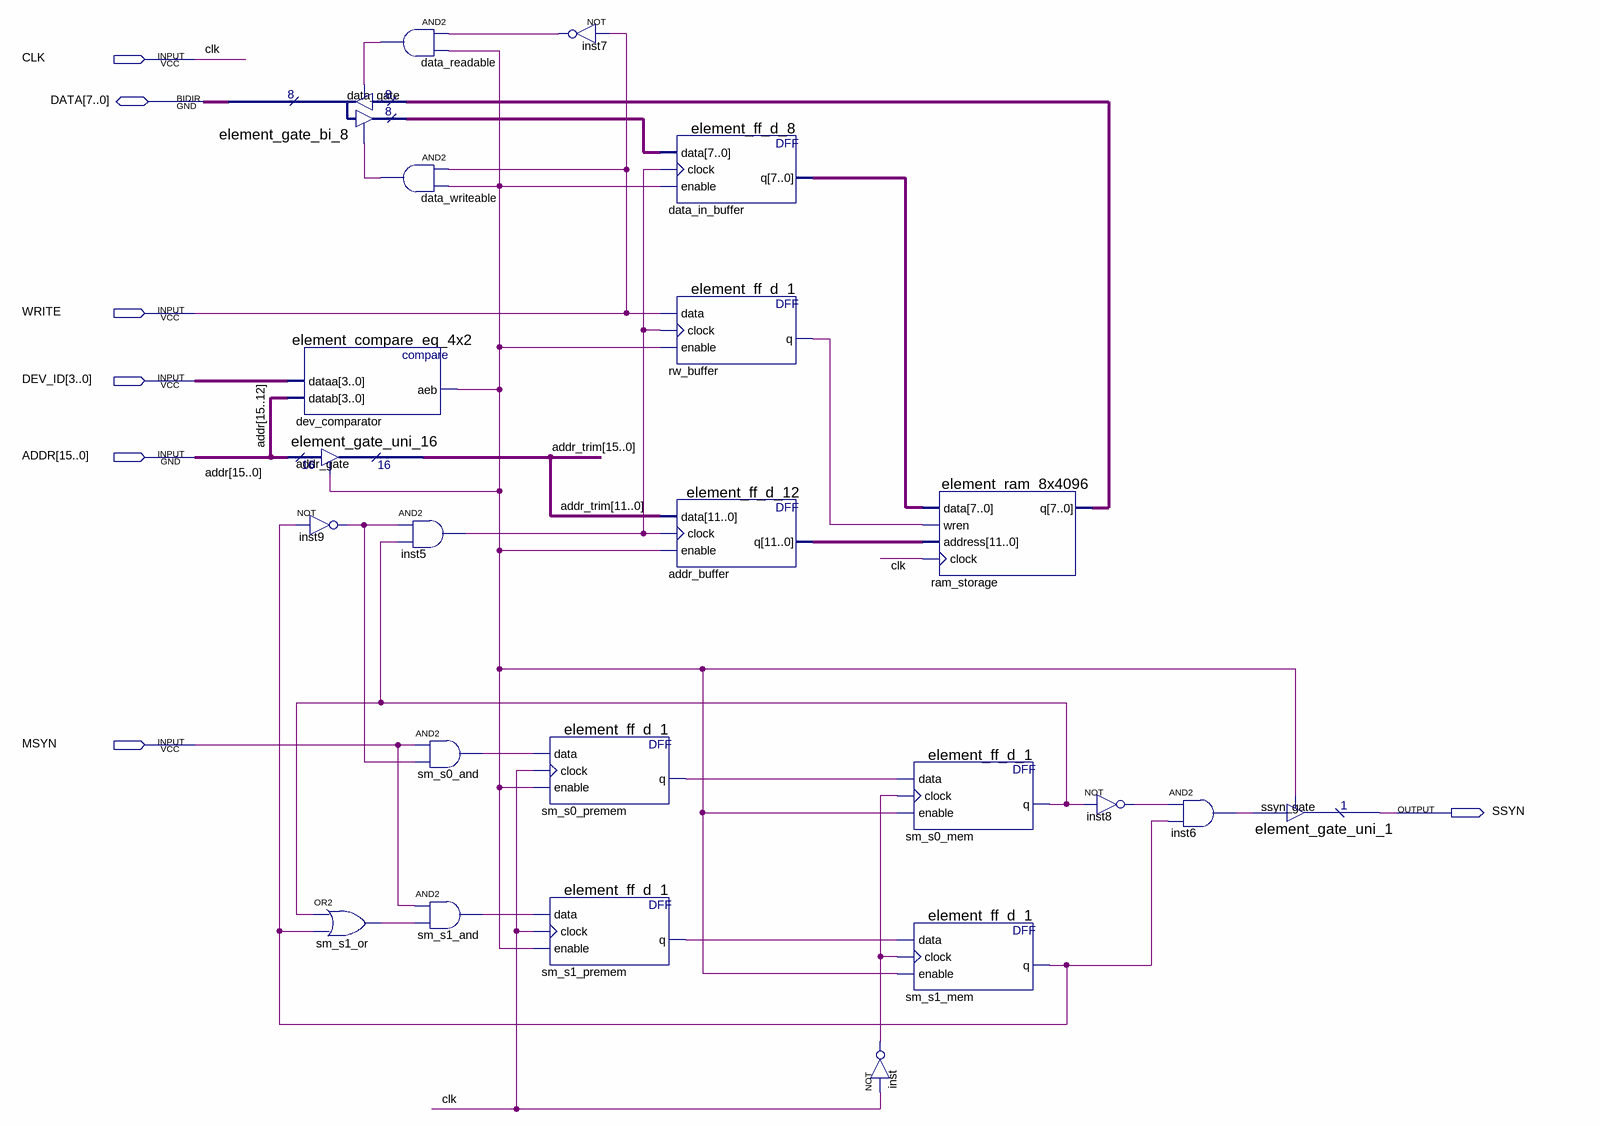
[diagram p0: schematic sheet]
// Quartus schematic block-ram.bdf as structural Verilog: 23 symbols, 7 pins
module \block-ram  (
  input  CLK,
  input  WRITE,
  input  [3:0] DEV_ID,
  input  [15:0] ADDR,
  input  MSYN,
  inout  [7:0] DATA,
  output SSYN
);

  wire data_readable_out, data_writeable_out, dev_comparator_aeb, inst5_out, inst6_out, inst7_out, inst8_out,
       inst9_out, inst_out, rw_buffer_q, sm_s0_and_out, sm_s0_mem_q, sm_s0_premem_q, sm_s1_and_out,
       sm_s1_mem_q, sm_s1_or_out, sm_s1_premem_q;
  wire [7:0] data_gate_result, data_in_buffer_q, ram_storage_q;
  wire [11:0] addr_buffer_q;
  wire [15:0] addr_trim;

  element_gate_bi_8 data_gate (
    .enabledt(data_readable_out), .data(ram_storage_q), .enabletr(data_writeable_out),
    .result(data_gate_result), .tridata(DATA));
  element_compare_eq_4x2 dev_comparator (.dataa(DEV_ID), .datab(ADDR[15:12]), .aeb(dev_comparator_aeb));
  element_gate_uni_16 addr_gate (.enabledt(dev_comparator_aeb), .data(ADDR), .tridata(addr_trim));
  not inst9 (inst9_out, sm_s1_mem_q);
  or sm_s1_or (sm_s1_or_out, sm_s0_mem_q, sm_s1_mem_q);
  and data_readable (data_readable_out, inst7_out, dev_comparator_aeb);
  and data_writeable (data_writeable_out, WRITE, dev_comparator_aeb);
  and inst5 (inst5_out, inst9_out, sm_s0_mem_q);
  and sm_s0_and (sm_s0_and_out, MSYN, inst9_out);
  and sm_s1_and (sm_s1_and_out, MSYN, sm_s1_or_out);
  not inst7 (inst7_out, WRITE);
  element_ff_d_1 sm_s0_premem (.data(sm_s0_and_out), .clock(CLK), .enable(dev_comparator_aeb), .q(sm_s0_premem_q));
  element_ff_d_1 sm_s1_premem (.data(sm_s1_and_out), .clock(CLK), .enable(dev_comparator_aeb), .q(sm_s1_premem_q));
  element_ff_d_8 data_in_buffer (
    .data(data_gate_result), .clock(inst5_out), .enable(dev_comparator_aeb), .q(data_in_buffer_q));
  element_ff_d_1 rw_buffer (.data(WRITE), .clock(inst5_out), .enable(dev_comparator_aeb), .q(rw_buffer_q));
  element_ff_d_12 addr_buffer (
    .data(addr_trim[11:0]), .clock(inst5_out), .enable(dev_comparator_aeb), .q(addr_buffer_q));
  not inst (inst_out, CLK);
  element_ram_8x4096 ram_storage (
    .data(data_in_buffer_q), .wren(rw_buffer_q), .address(addr_buffer_q), .clock(CLK), .q(ram_storage_q));
  element_ff_d_1 sm_s0_mem (.data(sm_s0_premem_q), .clock(inst_out), .enable(dev_comparator_aeb), .q(sm_s0_mem_q));
  element_ff_d_1 sm_s1_mem (.data(sm_s1_premem_q), .clock(inst_out), .enable(dev_comparator_aeb), .q(sm_s1_mem_q));
  not inst8 (inst8_out, sm_s0_mem_q);
  and inst6 (inst6_out, inst8_out, sm_s1_mem_q);
  element_gate_uni_1 ssyn_gate (.enabledt(dev_comparator_aeb), .data(inst6_out), .tridata(SSYN));
endmodule
